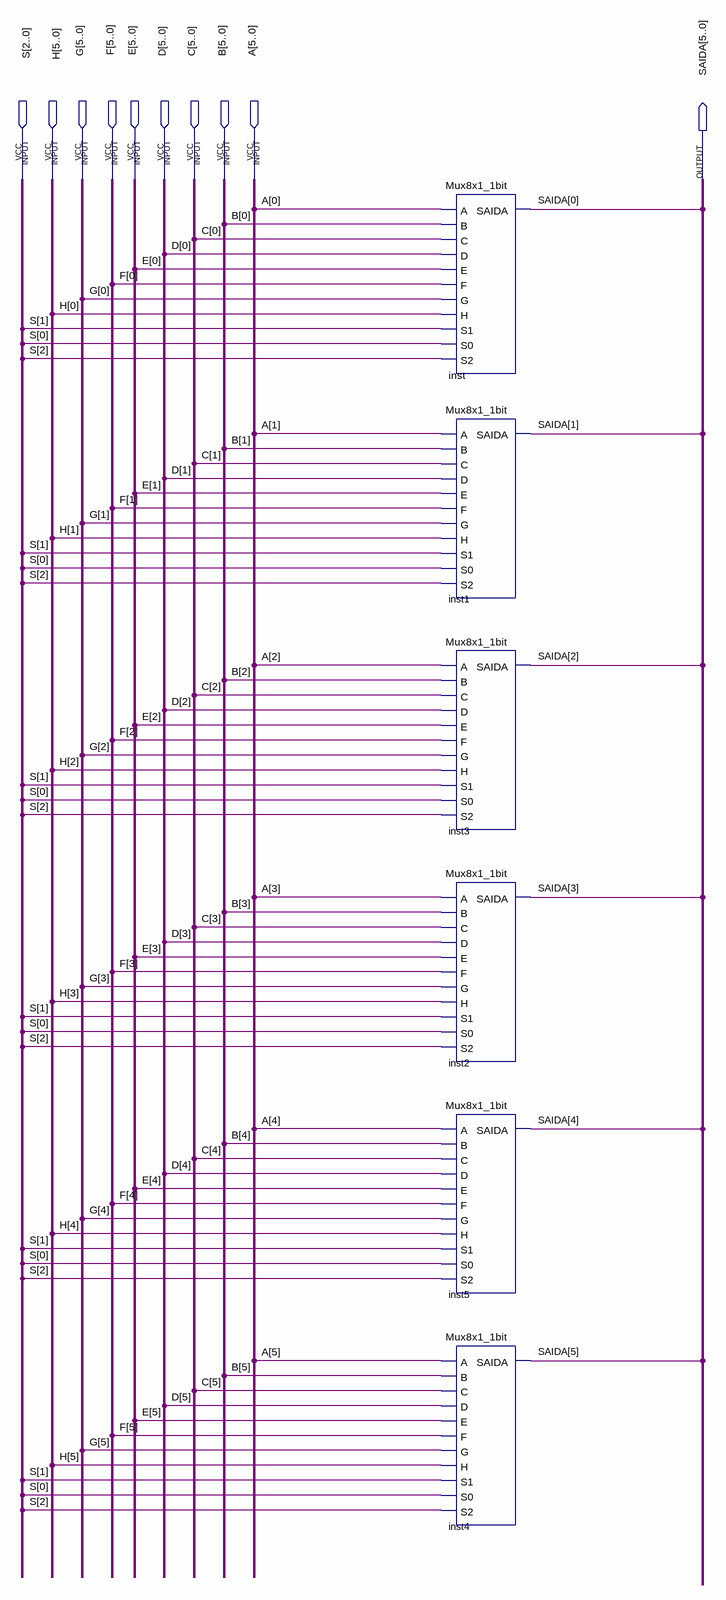
[diagram p0: schematic sheet]
// Quartus schematic Mux8x1_6bits.bdf as structural Verilog: 6 symbols, 10 pins
module Mux8x1_6bits (
  input  [2:0] S,
  input  [5:0] H,
  input  [5:0] G,
  input  [5:0] F,
  input  [5:0] E,
  input  [5:0] D,
  input  [5:0] C,
  input  [5:0] B,
  input  [5:0] A,
  output [5:0] SAIDA
);

  Mux8x1_1bit inst (
    .A(A[0]), .B(B[0]), .C(C[0]), .D(D[0]), .E(E[0]), .F(F[0]), .G(G[0]), .H(H[0]), .S1(S[1]), .S0(S[0]),
    .S2(S[2]), .SAIDA(SAIDA[0]));
  Mux8x1_1bit inst1 (
    .A(A[1]), .B(B[1]), .C(C[1]), .D(D[1]), .E(E[1]), .F(F[1]), .G(G[1]), .H(H[1]), .S1(S[1]), .S0(S[0]),
    .S2(S[2]), .SAIDA(SAIDA[1]));
  Mux8x1_1bit inst3 (
    .A(A[2]), .B(B[2]), .C(C[2]), .D(D[2]), .E(E[2]), .F(F[2]), .G(G[2]), .H(H[2]), .S1(S[1]), .S0(S[0]),
    .S2(S[2]), .SAIDA(SAIDA[2]));
  Mux8x1_1bit inst2 (
    .A(A[3]), .B(B[3]), .C(C[3]), .D(D[3]), .E(E[3]), .F(F[3]), .G(G[3]), .H(H[3]), .S1(S[1]), .S0(S[0]),
    .S2(S[2]), .SAIDA(SAIDA[3]));
  Mux8x1_1bit inst5 (
    .A(A[4]), .B(B[4]), .C(C[4]), .D(D[4]), .E(E[4]), .F(F[4]), .G(G[4]), .H(H[4]), .S1(S[1]), .S0(S[0]),
    .S2(S[2]), .SAIDA(SAIDA[4]));
  Mux8x1_1bit inst4 (
    .A(A[5]), .B(B[5]), .C(C[5]), .D(D[5]), .E(E[5]), .F(F[5]), .G(G[5]), .H(H[5]), .S1(S[1]), .S0(S[0]),
    .S2(S[2]), .SAIDA(SAIDA[5]));
endmodule
